# Altium schematic sheet POWER_DIAGRAM.SchDoc
size A4; SheetNumber: 3; SheetTotal: 9
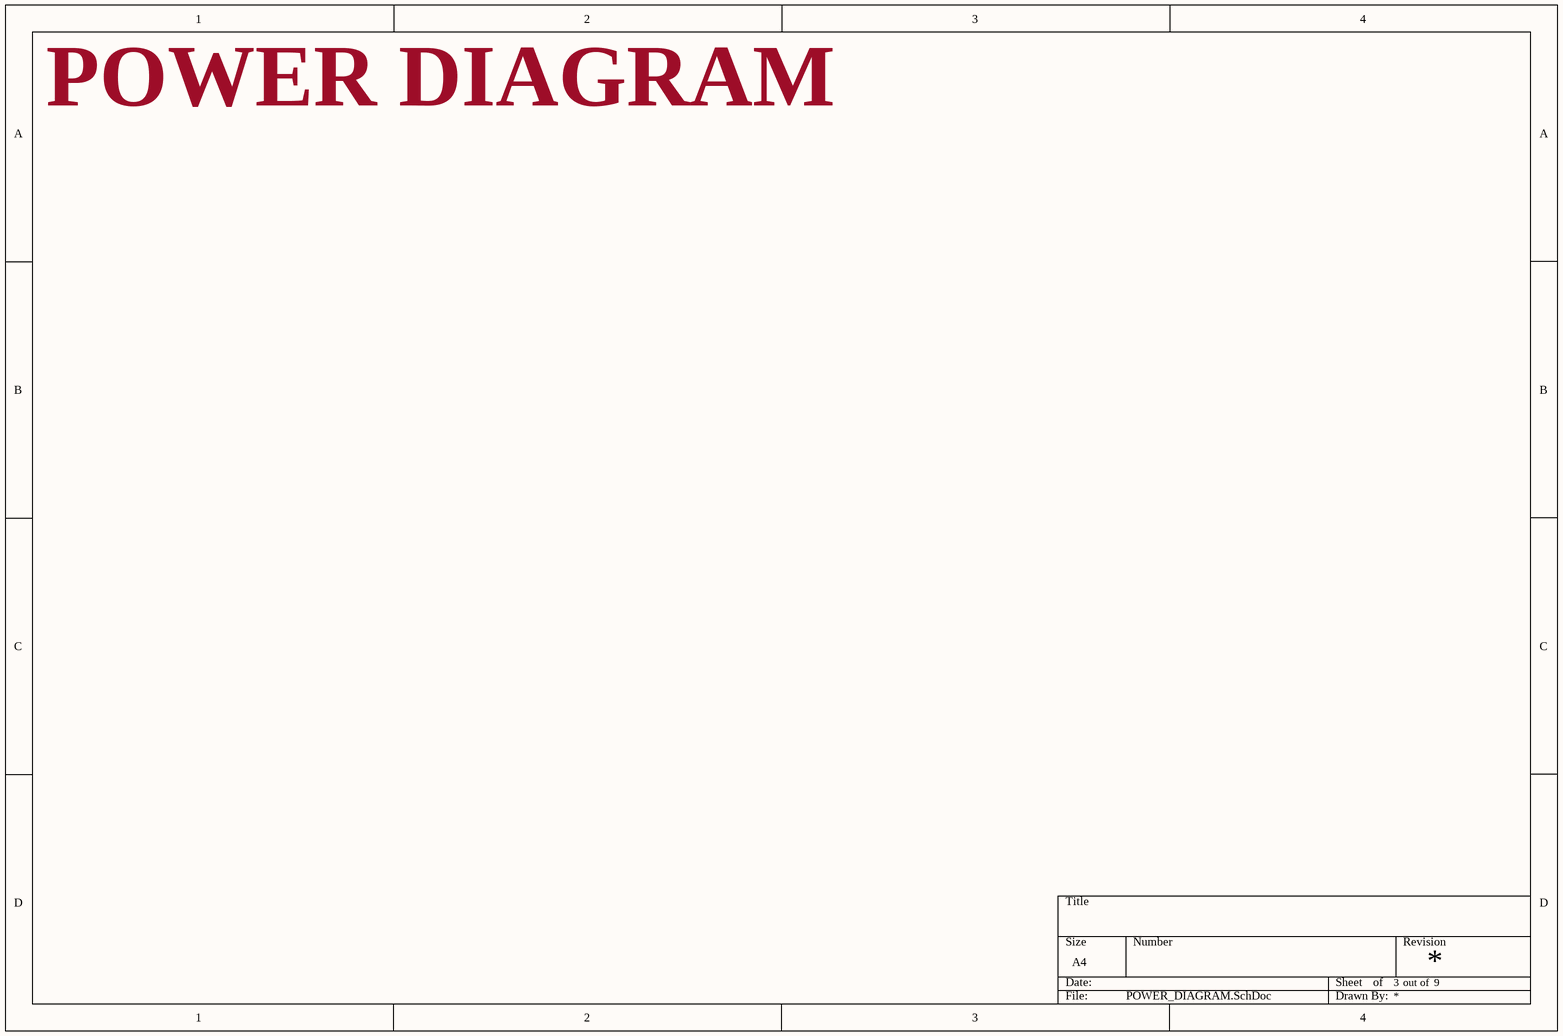
[diagram p0: POWER_DIAGRAM.SchDoc]

## Notes on the sheet
- POWER DIAGRAM
- out of